# EAGLE design lednode3 (EAGLE 6.5.0)
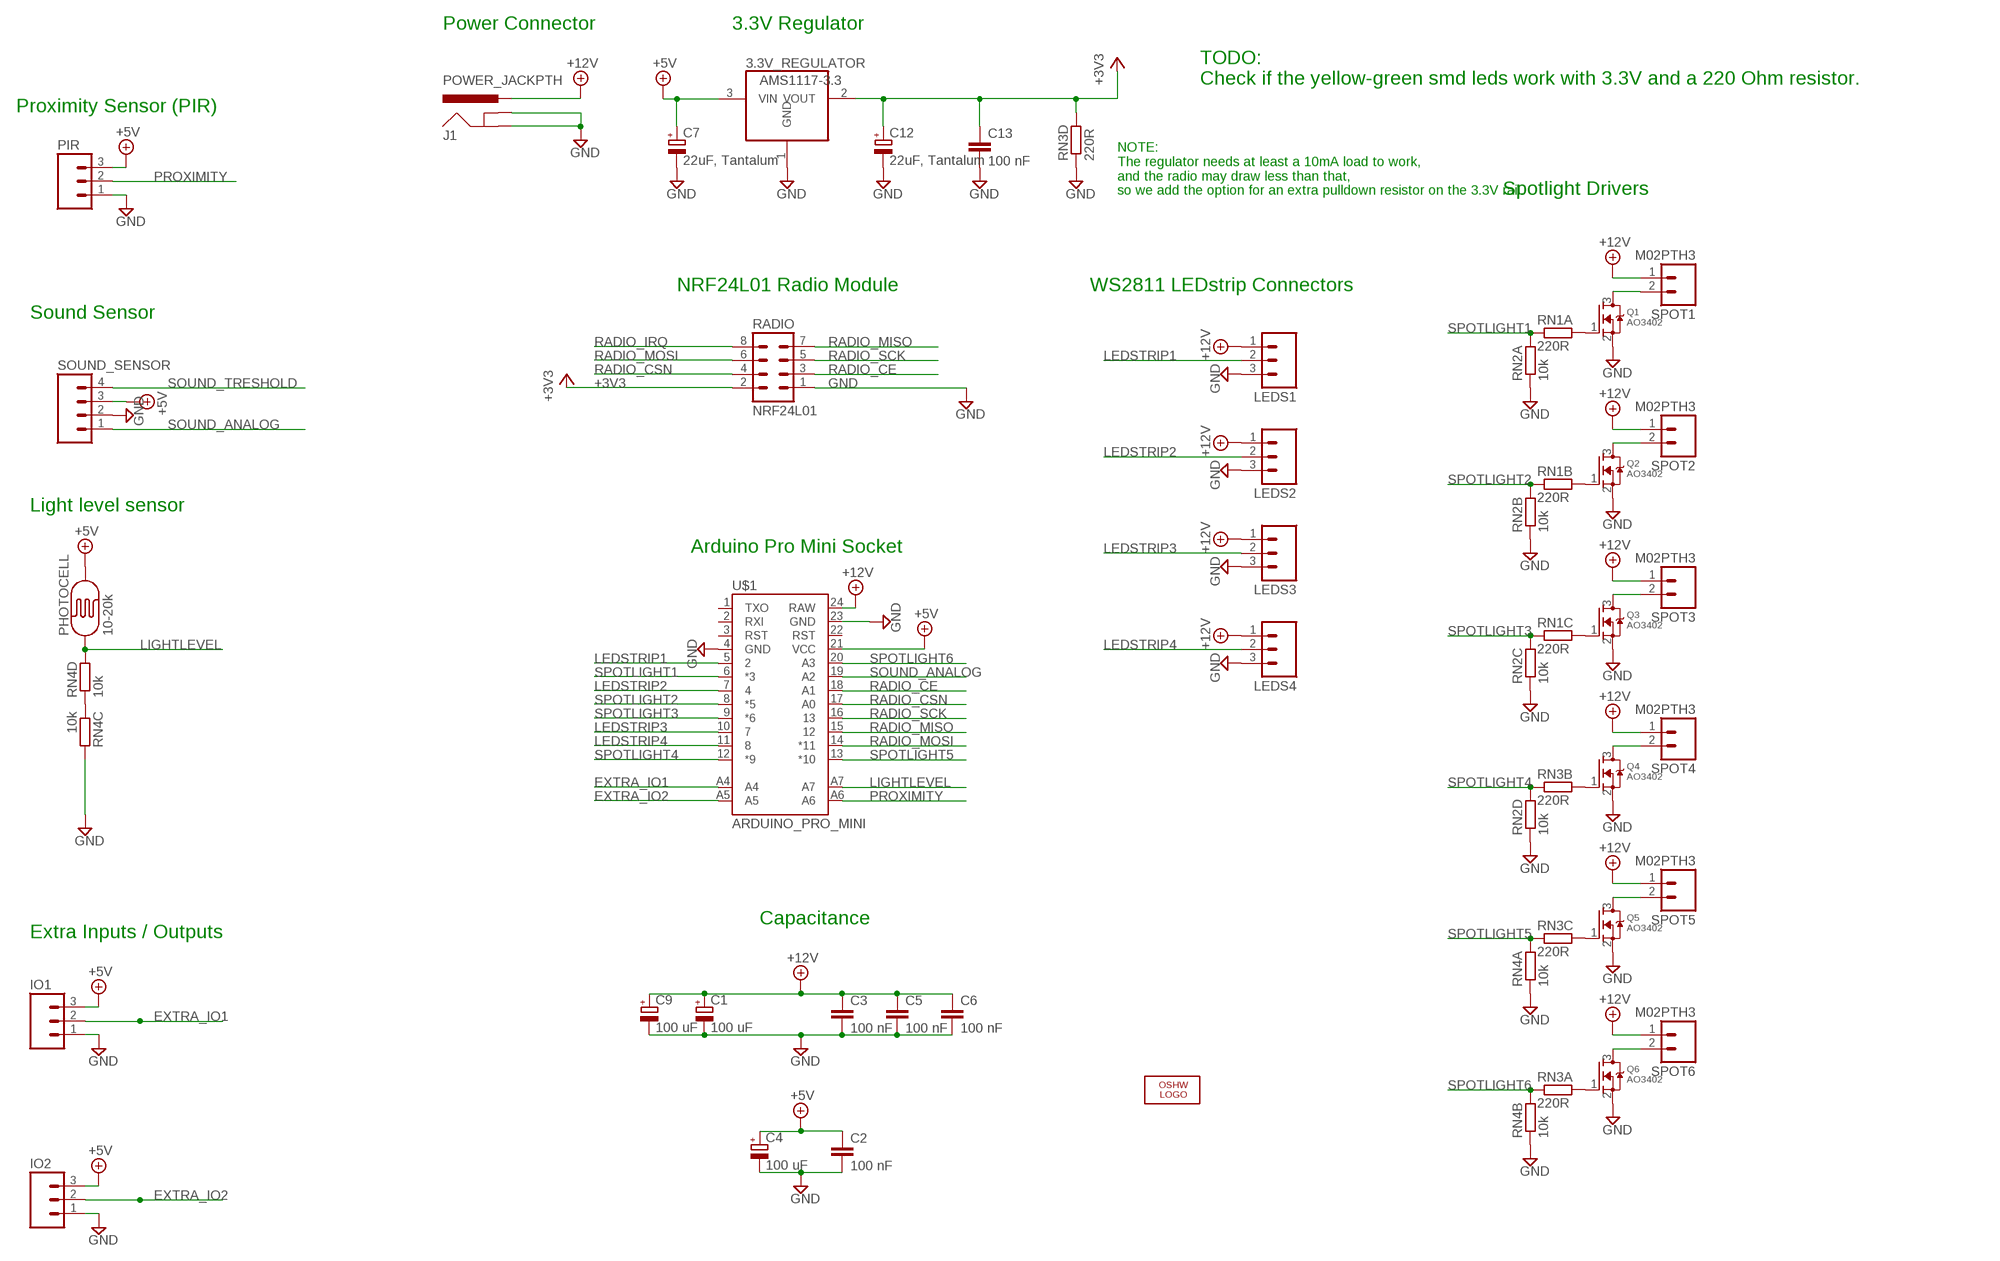
[diagram p0: schematic, sheet 1]

## Parts
3.3V_REGULATOR  AMS1117-3.3  REG1117  [SOT223]
C1  100 uF  CPOL-EUE2.5-6  [E2,5-6]
C2  100 nF  C-EUC0805  [C0805]
C3  100 nF  C-EUC0805  [C0805]
C4  100 uF  CPOL-EUE2.5-6  [E2,5-6]
C5  100 nF  C-EUC0805  [C0805]
C6  100 nF  C-EUC0805  [C0805]
C7  22uF, Tantalum  CPOL-EUSMCA  [SMC_A]
C9  100 uF  CPOL-EUE2.5-6  [E2,5-6]
C12  22uF, Tantalum  CPOL-EUSMCA  [SMC_A]
C13  100 nF  C-EUC0805  [C0805]
IO1  M03PTH  [1X03]
IO2  M03PTH  [1X03]
J1  POWER_JACKPTH  [POWER_JACK_PTH]
LEDS1  M03LONGPADS  [1X03_LONGPADS]
LEDS2  M03LONGPADS  [1X03_LONGPADS]
LEDS3  M03LONGPADS  [1X03_LONGPADS]
LEDS4  M03LONGPADS  [1X03_LONGPADS]
LOGO3  LOGO-OSHW-8MILX0100-NT  [OSHW_8X100_NOTEXT]
PHOTOCELL  10-20k  PHOTOCELLPTH  [PHOTOCELL]
PIR  M03PTH  [1X03]
Q1  AO3402  MOSFET-NWAVE  [SOT23-W]
Q2  AO3402  MOSFET-NWAVE  [SOT23-W]
Q3  AO3402  MOSFET-NWAVE  [SOT23-W]
Q4  AO3402  MOSFET-NWAVE  [SOT23-W]
Q5  AO3402  MOSFET-NWAVE  [SOT23-W]
Q6  AO3402  MOSFET-NWAVE  [SOT23-W]
RADIO  NRF24L01  MA04-2  [MA04-2]
RN1  220R  RESISTOR_ARRAY_4  [RN8P-4R-CRA06S]
RN2  10k  RESISTOR_ARRAY_4  [RN8P-4R-CRA06S]
RN3  220R  RESISTOR_ARRAY_4  [RN8P-4R-CRA06S]
RN4  10k  RESISTOR_ARRAY_4  [RN8P-4R-CRA06S]
SOUND_SENSOR  M041X04_NO_SILK  [1X04_NO_SILK]
SPOT1  M02PTH3  [1X02_LONGPADS]
SPOT2  M02PTH3  [1X02_LONGPADS]
SPOT3  M02PTH3  [1X02_LONGPADS]
SPOT4  M02PTH3  [1X02_LONGPADS]
SPOT5  M02PTH3  [1X02_LONGPADS]
SPOT6  M02PTH3  [1X02_LONGPADS]
U$1  ARDUINO_PRO_MINI  [ARDUINO_PRO_MINI]

## Nets
+3V3: 3.3V_REGULATOR.2(VOUT) C12.+ C13.1 RADIO.2 RN3.5
+5V: 3.3V_REGULATOR.3(VIN) C2.1 C4.+ C7.+ IO1.3 IO2.3 PHOTOCELL.2 PIR.3 SOUND_SENSOR.3 U$1.21(VCC)
+12V: C1.+ C3.1 C5.1 C6.1 C9.+ J1.PWR LEDS1.1 LEDS2.1 LEDS3.1 LEDS4.1 SPOT1.1 SPOT2.1 SPOT3.1 SPOT4.1 SPOT5.1 SPOT6.1 U$1.24(RAW)
EXTRA_IO1: IO1.2 U$1.A4
EXTRA_IO2: IO2.2 U$1.A5
GND: 3.3V_REGULATOR.1(GND) C1.- C2.2 C3.2 C4.- C5.2 C6.2 C7.- C9.- C12.- C13.2 IO1.1 IO2.1 J1.GND J1.GNDBREAK LEDS1.3 LEDS2.3 LEDS3.3 LEDS4.3 PIR.1 Q1.2(S) Q2.2(S) Q3.2(S) Q4.2(S) Q5.2(S) Q6.2(S) RADIO.1 RN2.1 RN2.2 RN2.3 RN2.4 RN3.4 RN4.1 RN4.2 RN4.6 SOUND_SENSOR.2 U$1.4(GND) U$1.23(GND)
LEDSTRIP1: LEDS1.2 U$1.5
LEDSTRIP2: LEDS2.2 U$1.7
LEDSTRIP3: LEDS3.2 U$1.10
LEDSTRIP4: LEDS4.2 U$1.11
LIGHTLEVEL: PHOTOCELL.1 RN4.5 U$1.A7
N$1: Q5.3(D) SPOT5.2
N$2: Q1.3(D) SPOT1.2
N$3: Q2.3(D) SPOT2.2
N$4: Q4.3(D) SPOT4.2
N$5: Q3.3(D) SPOT3.2
N$6: Q1.1(G) RN1.8
N$7: Q2.1(G) RN1.7
N$8: Q4.1(G) RN3.7
N$9: Q3.1(G) RN1.6
N$10: Q5.1(G) RN3.6
N$11: Q6.3(D) SPOT6.2
N$12: RN4.3 RN4.4
N$14: Q6.1(G) RN3.8
PROXIMITY: PIR.2 U$1.A6
RADIO_CE: RADIO.3 U$1.18(A1)
RADIO_CSN: RADIO.4 U$1.17(A0)
RADIO_IRQ: RADIO.8
RADIO_MISO: RADIO.7 U$1.15
RADIO_MOSI: RADIO.6 U$1.14(*11)
RADIO_SCK: RADIO.5 U$1.16
SOUND_ANALOG: SOUND_SENSOR.1 U$1.19(A2)
SOUND_TRESHOLD: SOUND_SENSOR.4
SPOTLIGHT1: RN1.1 RN2.8 U$1.6(*3)
SPOTLIGHT2: RN1.2 RN2.7 U$1.8(*5)
SPOTLIGHT3: RN1.3 RN2.6 U$1.9(*6)
SPOTLIGHT4: RN2.5 RN3.2 U$1.12(*9)
SPOTLIGHT5: RN3.3 RN4.8 U$1.13(*10)
SPOTLIGHT6: RN3.1 RN4.7 U$1.20(A3)
Unconnected: RN1.4 RN1.5 U$1.1(TXO) U$1.2(RXI) U$1.3(RST) U$1.22(RST)

## Notes on the sheet
- Power Connector | 3.3V Regulator
- TODO:
  Check if the yellow-green smd leds work with 3.3V and a 220 Ohm resistor.
- Proximity Sensor (PIR)
- NOTE:
  The regulator needs at least a 10mA load to work, 
  and the radio may draw less than that, 
  so we add the option for an extra pulldown resistor on the 3.3V rail.
- Spotlight Drivers
- NRF24L01 Radio Module | WS2811 LEDstrip Connectors
- Sound Sensor
- Light level sensor
- Arduino Pro Mini Socket
- Capacitance
- Extra Inputs / Outputs

## Library data of the parts
3.3V_REGULATOR = burr-brown:REG1117: 800mA and 1A Low Dropout (LDO) Positive Regulator 1.8V, 2.5V, 2.85V, 3.3V, 5V, and Adj; MPN: REG1117; OC_FARNELL: 1097566; OC_NEWARK: 14P6981
C1 C4 C7 C9 C12 = rcl:CPOL-EU: POLARIZED CAPACITOR, European symbol
C2 C3 C5 C6 C13 = rcl:C-EU: CAPACITOR, European symbol
IO1 IO2 LEDS1-LEDS4 PIR = SparkFun-Connectors:M03: Header 3 Standard 3-pin 0.1" header. Use with straight break away headers (SKU : PRT-00116), right angle break away headers (PRT-00553), swiss pins (PRT-00743), machine pins (PRT-00117), and female headers (PRT-00115). Molex polarized connector foot print use with SKU : PRT-08232 with associated crimp pins and housings.
J1 = SparkFun-Connectors:POWER_JACK: Power Jack This is the standard 5.5mm barrel jack for power. The PTH is the most common, proven, reliable, footprint. The Slot footprint only works if the mill layer is transmitted to the PCB fab house so be warned. Mating wall wart : TOL-00298 (and others); PROD_ID: PRT-00119
LOGO3 = Logo:LOGO-OSHW-8MIL
PHOTOCELL = SparkFun-Sensors:PHOTOCELL: CdS photoresistor. This is a low cost way to detect light levels. Resistance decreases with more incoming light. SparkFun SKU: SEN-09088
Q1-Q6 = adafruit:MOSFET-N: N-Channel Mosfet 2N7002E - 60V 260mA SOT23 [Digikey: 2N7002ET1GOSTR-ND] - REEL BSH103 - 30V 850mA SOT23 [Digikey: 568-5013-1-ND]
RADIO = con-lstb:MA04-2: PIN HEADER; OC_FARNELL: unknown; OC_NEWARK: unknown
RN1-RN4 = dp_devices:RESISTOR_ARRAY_4: 4 Resistor Array 0603
SOUND_SENSOR = SparkFun-Connectors:M04: Header 4 Standard 4-pin 0.1" header. Use with straight break away headers (SKU : PRT-00116), right angle break away headers (PRT-00553), swiss pins (PRT-00743), machine pins (PRT-00117), and female headers (PRT-00115). Molex polarized connector foot print use with SKU : PRT-08231 with associated crimp pins and housings. 1MM SMD Version SKU: PRT-10208
SPOT1-SPOT6 = SparkFun-Connectors:M02: Standard 2-pin 0.1" header. Use with - straight break away headers ( PRT-00116) - right angle break away headers (PRT-00553) - swiss pins (PRT-00743) - machine pins (PRT-00117) - female headers (PRT-00115) Molex polarized connector foot print use with: PRT-08233 with associated crimp pins and housings. 2.54_SCREWTERM for use with PRT-10571. 3.5mm Screw Terminal footprints for PRT-08084 5mm Screw Terminal footprints for use with PRT-08433
U$1 = SparkFun-Boards-with-arduino-pro-mini-without-connection-pins:ARDUINO_PRO_MINI

## Board
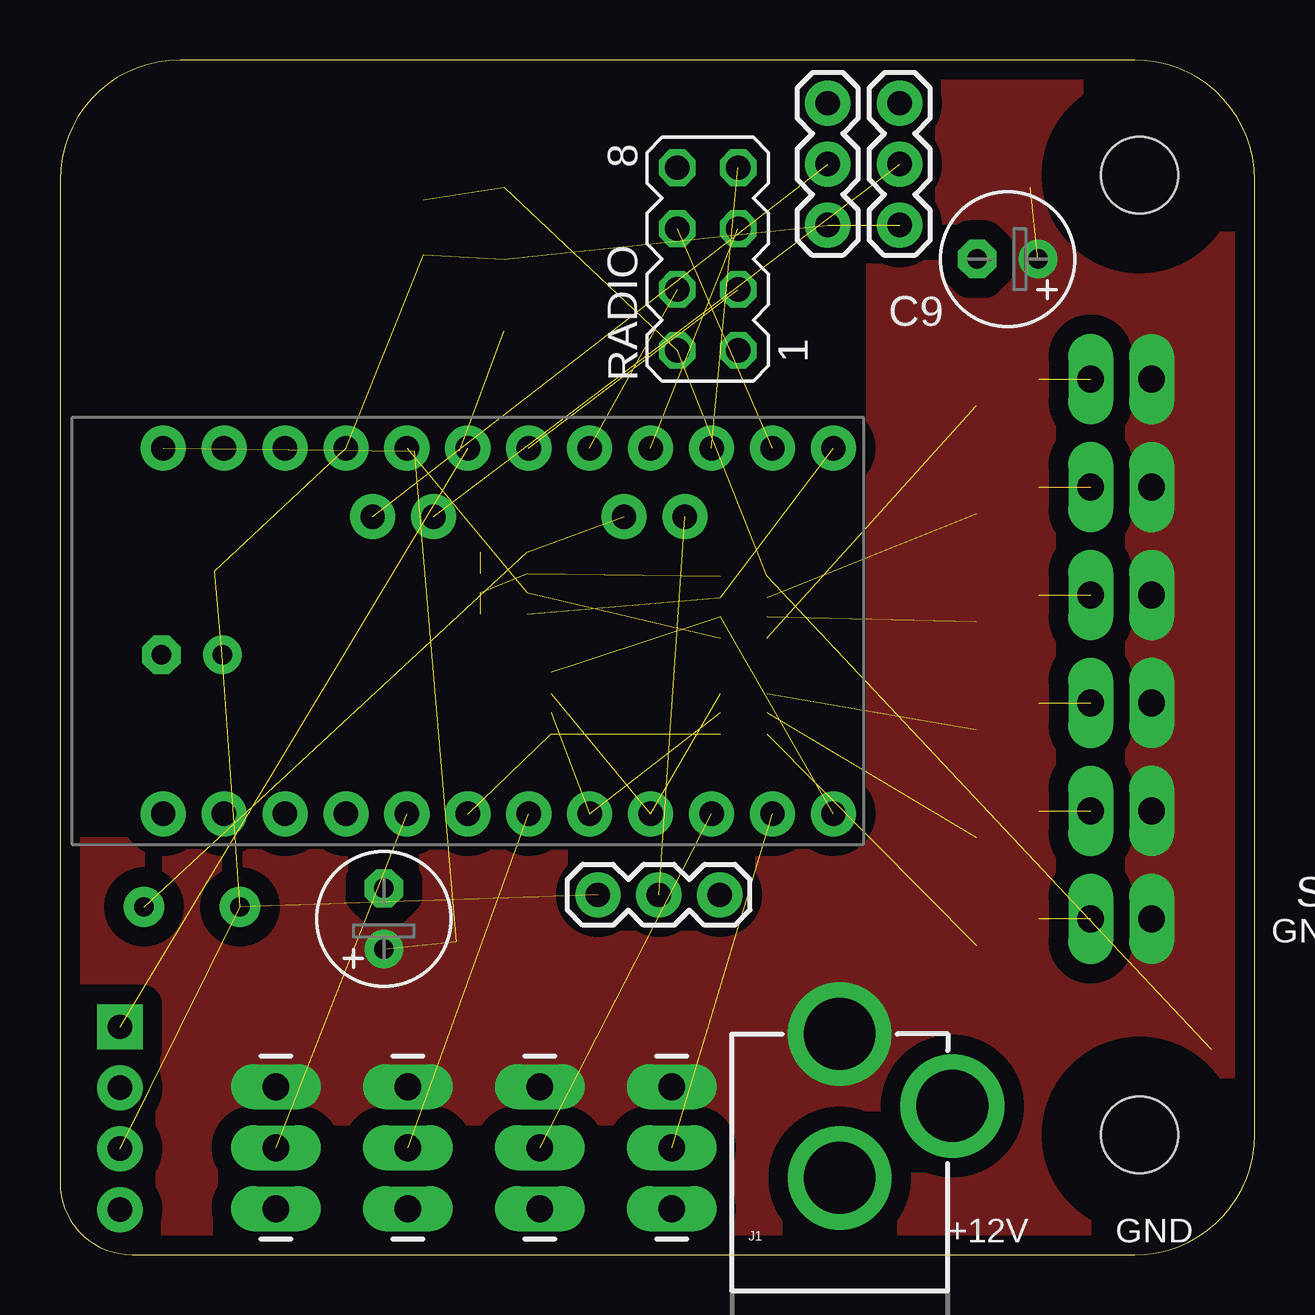
[diagram p1: board, top side]
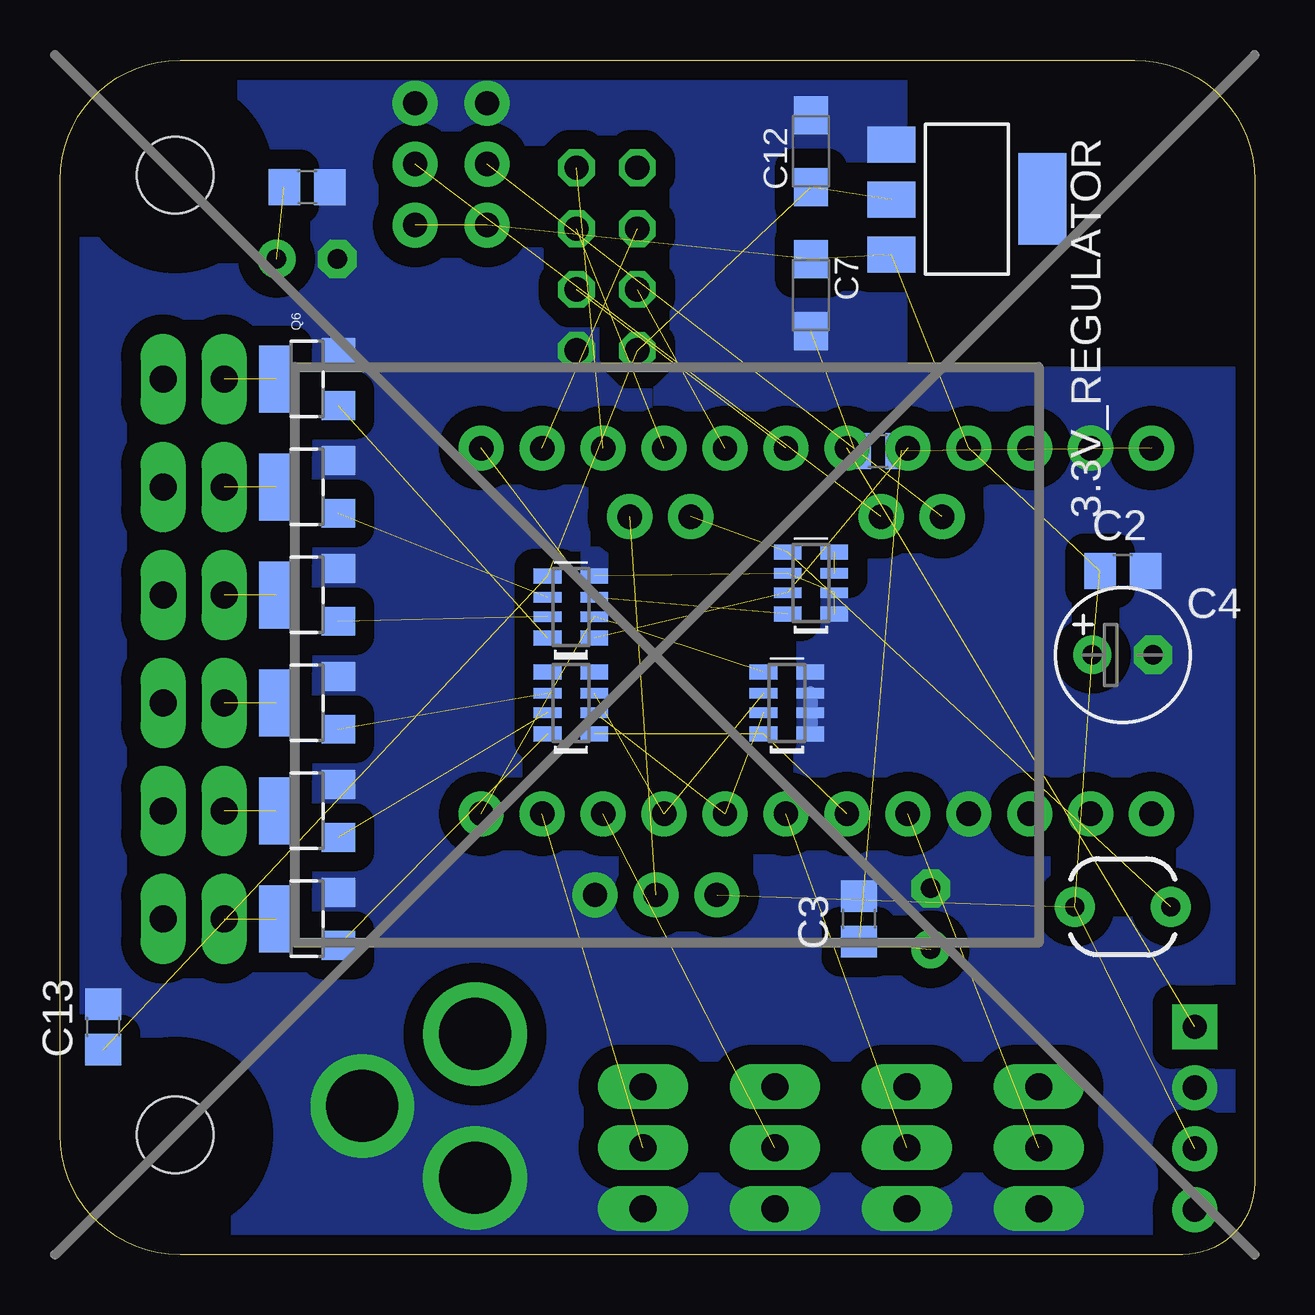
[diagram p2: board, bottom side, seen from below]

Size 49.8 x 49.8 mm. Coordinates in mm from the lower left corner, seen from the top.
Outline: 0,44.8 0,3 arc90 3,0 44.8,0 arc90 49.8,5 49.8,44.8 arc90 44.8,49.8 5,49.8 arc90 0,44.8
Copper layers (1*16): Top 0.035mm / dielectric 1.5mm / Bottom 0.035mm
Design rules "SeeedStudio_2layer_DRU_no_angle_20140221": minimum track width 6mil, minimum drill 12mil, track to track 6mil, track to pad 6mil, pad to pad 6mil, via to via 6mil, smd to smd 0mil, copper to edge 10mil, drill to drill 10mil, minimum pad ring 10mil, minimum via ring 6mil, stop-mask expansion 2mil, vias tented up to drill 100mil, thermal gap 10mil
Holes 3.2 mm at 45,45 45,5
tRestrict: area 43,3 to 47,7; area 43,43 to 47,47
bRestrict: area 43,3 to 47,7; area 43,43 to 47,47

### Footprints (pad centres in the part's own frame; a part is rotated, then mirrored left to right if it is on the bottom)
SOT223 = smd 1.499 x 2.007: 1 -2.261,-3.15; 2 0.025,-3.15; 3 2.311,-3.15 | smd 3.81 x 2.007: 4 0,3.15
E2,5-6 = drill 0.813 pad 1.6: + -1.27,0 | drill 0.813 pad 1.6 octagon: - 1.27,0
C0805 = smd 1.3 x 1.5: 1 -0.95,0; 2 0.95,0
SMC_A = smd 1.6 x 1.4: + -1.5,0; - 1.5,0
1X03 = drill 1.016 pad 1.88: 1 0,0; 2 2.54,0; 3 5.08,0
POWER_JACK_PTH = drill 2.997 pad 4.318: GND 0,7.7; GNDBREAK 4.7,10.7; PWR 0,13.7
1X03_LONGPADS = drill 1.118 pad 1.88 long: 1 0,0; 2 2.54,0; 3 5.08,0
PHOTOCELL = drill 0.8 pad 1.676: 1 -2,0; 2 2,0
SOT23-W = smd 1.2 x 1.4: 1 -1.1,-1.3; 2 1.1,-1.3 | smd 2.8 x 1.4: 3 0,1.3
MA04-2 = drill 1.016 octagon: 1 -3.81,-1.27; 2 -3.81,1.27; 3 -1.27,-1.27; 4 -1.27,1.27; 5 1.27,-1.27; 6 1.27,1.27; 7 3.81,-1.27; 8 3.81,1.27
RN8P-4R-CRA06S = smd 0.63 x 1.15: 1 -1.295,-0.975; 4 1.295,-0.975; 5 1.295,0.975; 8 -1.295,0.975 | smd 0.44 x 1.15: 2 -0.4,-0.975; 3 0.4,-0.975; 6 0.4,0.975; 7 -0.4,0.975
1X04_NO_SILK = drill 1.016 pad 1.88 square: 1 0,0 | drill 1.016 pad 1.88: 2 2.54,0; 3 5.08,0; 4 7.62,0
1X02_LONGPADS = drill 1.118 pad 1.88 long: 1 0,0; 2 2.54,0
ARDUINO_PRO_MINI = drill 1.016 pad 1.88: 1 -7.62,12.7; 2 -7.62,10.16; 3 -7.62,7.62; 4 -7.62,5.08; 5 -7.62,2.54; 6 -7.62,0; 7 -7.62,-2.54; 8 -7.62,-5.08; 9 -7.62,-7.62; 10 -7.62,-10.16; 11 -7.62,-12.7; 12 -7.62,-15.24; 13 7.62,-15.24; 14 7.62,-12.7; 15 7.62,-10.16; 16 7.62,-7.62; 17 7.62,-5.08; 18 7.62,-2.54; 19 7.62,0; 20 7.62,2.54; 21 7.62,5.08; 22 7.62,7.62; 23 7.62,10.16; 24 7.62,12.7; A4 4.763,1.429; A5 4.763,3.969; A6 4.763,-9.049; A7 4.763,-6.509

### Placement (x,y rotation side)
3.3V_REGULATOR  12,44 270 bottom
C1  13.5,14 90 top
C2  5.5,28.5 0 bottom
C3  16.5,14 90 bottom
C4  5.5,25 0 bottom
C5  15.7,33.5 180 bottom
C6  39.5,44.5 0 bottom
C7  18.5,40 270 bottom
C9  39.5,41.5 180 top
C12  18.5,46 90 bottom
C13  48,9.5 90 bottom
IO1  35,48 270 top
IO2  32,48 270 top
J1  32.5,-4.5 0 top
LEDS1  9,7 270 top
LEDS2  14.5,7 270 top
LEDS3  20,7 270 top
LEDS4  25.5,7 270 top
LOGO3  59.5,1.5 0 bottom  (outside the outline)
PHOTOCELL  5.5,14.5 180 bottom
PIR  27.5,15 180 top
Q1  39.5,14 90 bottom
Q2  39.5,18.5 90 bottom
Q3  39.5,23 90 bottom
Q4  39.5,27.5 90 bottom
Q5  39.5,32 90 bottom
Q6  39.5,36.5 90 bottom
RADIO  27,41.5 90 top
RN1  28.5,23 90 bottom
RN2  19.5,23 90 bottom
RN3  28.5,27 90 bottom
RN4  18.5,28 90 bottom
SOUND_SENSOR  2.5,9.5 270 top
SPOT1  45.5,14 180 top
SPOT2  45.5,18.5 180 top
SPOT3  45.5,23 180 top
SPOT4  45.5,27.5 180 top
SPOT5  45.5,32 180 top
SPOT6  45.5,36.5 180 top
U$1  17,26 90 top

### Tracks (layer width: path | path; a pad name or v marks a point on that pad's centre or on a via)
+3V3  (4 unrouted)
+5V  (9 unrouted)
+12V  (4 unrouted)
  pour Top (isolate 0.813, no thermals): 0,17 34,17 34,50 50,50 50,0 0,0
EXTRA_IO1  (1 unrouted)
EXTRA_IO2  (1 unrouted)
GND  (4 unrouted)
  Bottom 0.61: RN2.1 RN2.2 RN2.3
  pour Bottom (isolate 0.813, no thermals): 0,36.5 15,36.5 15,50 50,50 50,0 0,0
LEDSTRIP1  (1 unrouted)
LEDSTRIP2  (1 unrouted)
LEDSTRIP3  (1 unrouted)
LEDSTRIP4  (1 unrouted)
LIGHTLEVEL  (2 unrouted)
N$1  (1 unrouted)
N$2  (1 unrouted)
N$3  (1 unrouted)
N$4  (1 unrouted)
N$5  (1 unrouted)
N$6  (1 unrouted)
N$7  (1 unrouted)
N$8  (1 unrouted)
N$9  (1 unrouted)
N$10  (1 unrouted)
N$11  (1 unrouted)
N$12  (1 unrouted)
N$14  (1 unrouted)
PROXIMITY  (1 unrouted)
RADIO_CE  (1 unrouted)
RADIO_CSN  (1 unrouted)
RADIO_MISO  (1 unrouted)
RADIO_MOSI  (1 unrouted)
RADIO_SCK  (1 unrouted)
SOUND_ANALOG  (1 unrouted)
SPOTLIGHT1  (2 unrouted)
SPOTLIGHT2  (2 unrouted)
SPOTLIGHT3  (2 unrouted)
SPOTLIGHT4  (2 unrouted)
SPOTLIGHT5  (2 unrouted)
SPOTLIGHT6  (2 unrouted)

### Text on the board
tSilk: InA | GND | N/C | +5V | IN/OUT 2 | PIR Sensor | IN/OUT 1 | 2 | 1 | Green | 5 | +5V | IO2 | GND | +5V | GND | +5V | IO1 | GND | GND | FTDI Header | Movement | +12V | Sound Sensor | Spot 5 | Spot 5 | Black | GND | Arduino Pro Mini | +12V | Power | GND | +12V | Spot 4 | Spot 4 | Spot 1 | Spot 2 | Spot 3 | GND | +12V | +12V | +12V | GND | LEDMess v3.0 | GND | GND | Dat | 12V | GND | Spot 1 | Spot 3 | +12V | GND | Spot 2 | Leds 1
_tsilk: TODO: Check size of / * Sound sensor module / * Radio module / * PIR module / / And make sure they can be mounted at the same time (on top?). | Programming / Connector
_bsilk: RXI | RST | GND | TXO | github.com/zzorn/ledmess | LEDMess Node v2.0